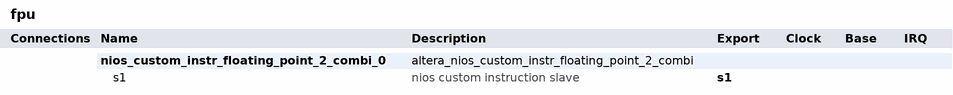
[diagram p0: system contents]
# Platform Designer (Qsys) system fpu, MAX 10 10M50DAF484C7G
# Parameters at their usual value, and those the tool derives, are not listed.
package require -exact qsys 18.1
create_system fpu
set_project_property DEVICE_FAMILY {MAX 10}
set_project_property DEVICE 10M50DAF484C7G

add_instance nios_custom_instr_floating_point_2_combi_0 altera_nios_custom_instr_floating_point_2_combi 18.1
set_instance_property nios_custom_instr_floating_point_2_combi_0 AUTO_EXPORT true
set_instance_parameter_value nios_custom_instr_floating_point_2_combi_0 arithmetic_present 1
set_instance_parameter_value nios_custom_instr_floating_point_2_combi_0 comparison_present 1

# exported interfaces
add_interface s1 nios_custom_instruction end
set_interface_property s1 EXPORT_OF nios_custom_instr_floating_point_2_combi_0.s1

set_interconnect_requirement {$system} qsys_mm.clockCrossingAdapter HANDSHAKE
set_interconnect_requirement {$system} qsys_mm.enableEccProtection FALSE
set_interconnect_requirement {$system} qsys_mm.insertDefaultSlave FALSE
set_interconnect_requirement {$system} qsys_mm.maxAdditionalLatency 1

save_system fpu.qsys
